# EAGLE schematic power (EAGLE 7.4.0)
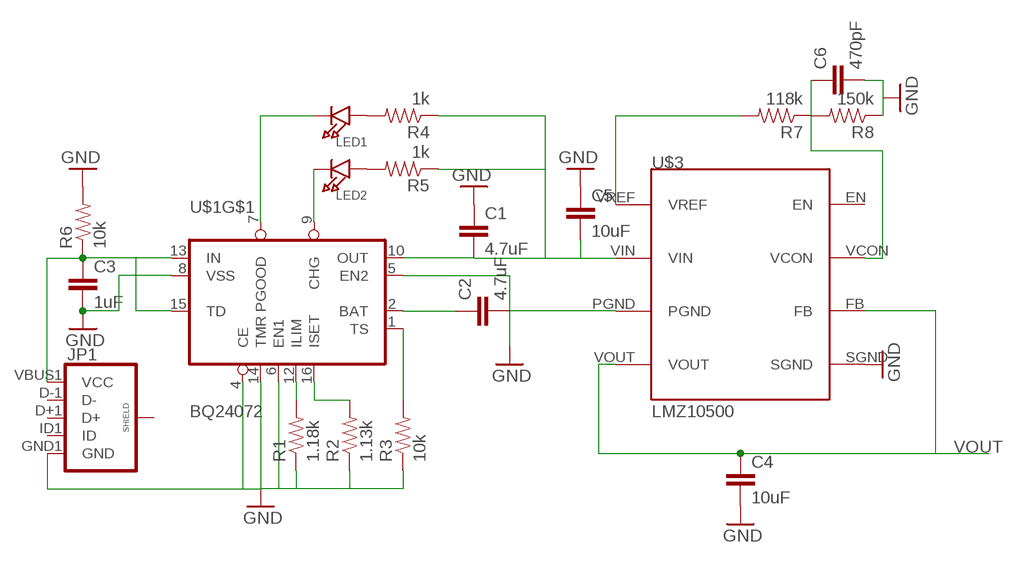
[diagram p0: schematic, sheet 1]

## Parts
C1  4.7uF  CAP0603-CAP  [0603-CAP]
C2  4.7uF  CAP0603-CAP  [0603-CAP]
C3  1uF  CAP0603-CAP  [0603-CAP]
C4  10uF  CAP0603-CAP  [0603-CAP]
C5  10uF  CAP0603-CAP  [0603-CAP]
C6  470pF  CAP0603-CAP  [0603-CAP]
JP1  USB_MICROB_PLUGCONN-11752  [USB-B-MICRO-SMD_V03]
LED1  LED0603  [CHIPLED_0603]
LED2  LED0603  [CHIPLED_0603]
R1  1.18k  RESISTOR0603  [0603-RES]
R2  1.13k  RESISTOR0603  [0603-RES]
R3  10k  RESISTOR0603  [0603-RES]
R4  1k  RESISTOR0603  [0603-RES]
R5  1k  RESISTOR0603  [0603-RES]
R6  10k  RESISTOR0603  [0603-RES]
R7  118k  RESISTOR0603-RES  [0603-RES]
R8  150k  RESISTOR0603-RES  [0603-RES]
U$1  BQ24072  [S-PVQFN-N16]
U$3  LMZ10500  [LMZ10500]

## Nets
GND: C1.1 C2.2 C3.2 C4.2 C5.1 C6.2 JP1.GND1(GND) R1.1 R2.1 R3.1 R6.2 R8.1 U$1.4(CE) U$1.5(EN2) U$1.6(EN1) U$1.8(VSS) U$1.14(TMR) U$3.PGND U$3.SGND
N$1: R7.2 U$3.VREF
N$2: C6.1 R7.1 R8.2 U$3.VCON
N$3: R1.2 U$1.12(ILIM)
N$5: R2.2 U$1.16(ISET)
N$6: R3.2 U$1.1(TS)
N$8: C2.1 U$1.2(BAT)
N$9: C1.2 C5.2 R4.1 R5.1 U$1.10(OUT) U$3.VIN
N$10: LED1.A R4.2
N$11: LED2.A R5.2
N$12: LED2.C U$1.9(CHG)
N$13: LED1.C U$1.7(PGOOD)
N$14: C3.1 JP1.VBUS1(VCC) R6.1 U$1.13(IN) U$1.15(TD)
VOUT: C4.1 U$3.FB U$3.VOUT
Unconnected: JP1.D+1(D+) JP1.D-1(D-) JP1.ID1(ID) JP1.SHIELD1(SHIELD) JP1.SHIELD2(SHIELD) JP1.SHIELD3(SHIELD) U$1.TH(TH:TH) U$3.EN

## Library data of the parts
C1-C6 = SparkFun-Capacitors:CAP: Capacitor Standard 0603 ceramic capacitor, and 0.1" leaded capacitor.
JP1 = SparkFun-Connectors:USB_MICROB_PLUG: USB Micro-B connectors Some male, some female. Watch your step!; PROD_ID: CONN-11752
LED1 LED2 = microbuilder:LED: LED 0603 - 0603 Surface Mount Package 2mA: Green LED - Low Power (3.9mcd, 2ma, 1.7Vf) - Digikey: 475-2709-2-ND Orange LED - Low Power (9.8mcd, 2ma, 1.8Vf) - Digikey: 475-1194-2-ND Red LED - Low Power (5mcd, 2ma, 1.8Vf) - Digikey: 475-1195-2-ND Yellow LED - Low Power (7mcd, 2ma, 1.8Vf) - Digikey: 475-1196-2-ND 5mA: Blue LED - Low Power (17mcd, 5ma, 2.9Vf) - Digikey: LNJ937W8CRACT-ND 0805 - 0805 Surface Mount Package 2mA: Red LED (8.8mcd, 2mA, 1.8Vf, Clear) - Low Power [Digikey: 475-2510-1-ND] Green LED (5mcd, 2mA, 1.8Vf, Clear) - Low Power [Digikey: 475-2730-1-ND] Yellow LED (11.3mcd, 2mA, 1.8Vf, Clear) - Low Power [Digikey: 475-2555-1-ND] 20mA: Red LED (104mcd, 20mA, Diffused) - LS R976 [Digikey: 475-1278-6-ND] Red LED (12mcd, 20mA, 2.0Vf, Clear) - APT2012EC [Digikey: 754-1128-1-ND] Green LED (15mcd, 20mA, 2.2Vf, Clear) - APT2012GC [Digikey: 754-1131-1-ND] Orange LED (160mcd, 20mA, 2.1Vf, Clear) - APT2012SECK [Digikey: 754-1130-1-ND] 1206 - 1206 Surface Mount Package Green LED (26mcd, 20mA, Diffused) - LG N971 [Digikey: 475-1407-6-ND] Red LED (15mcd, 20mA, Diffused) - LH N974 [Digikey: 475-1416-6-ND]
R1-R6 = SparkFun-Resistors:RESISTOR: Resistor Basic schematic elements and footprints for 0603, 1206, and PTH resistors.
R7 R8 = SparkFun-Passives:RESISTOR: Resistor Basic schematic elements and footprints for 0603, 1206, and PTH resistors.
U$1 = Simplex-ICs:BQ24072: TI BQ24072 - Li battery charger and power path management ic
U$3 = LMZ10500:LMZ10500